# EasyEDA Pro project EXO-IMU3.eprj, schematic Schematic3

## Sheets
1 P1: Create Date: 2024-08-14; Page Name: P1; Project Name: EXO-IMU3; Schematic Name: Schematic3; Update Date: 2024-08-14; Company: EasyEDA.com; Drawed: EasyEDA Pro; Page Size: A4; Part Number: JLCPCB-002; Reviewed: EasyEDA Pro; Version: V0.1
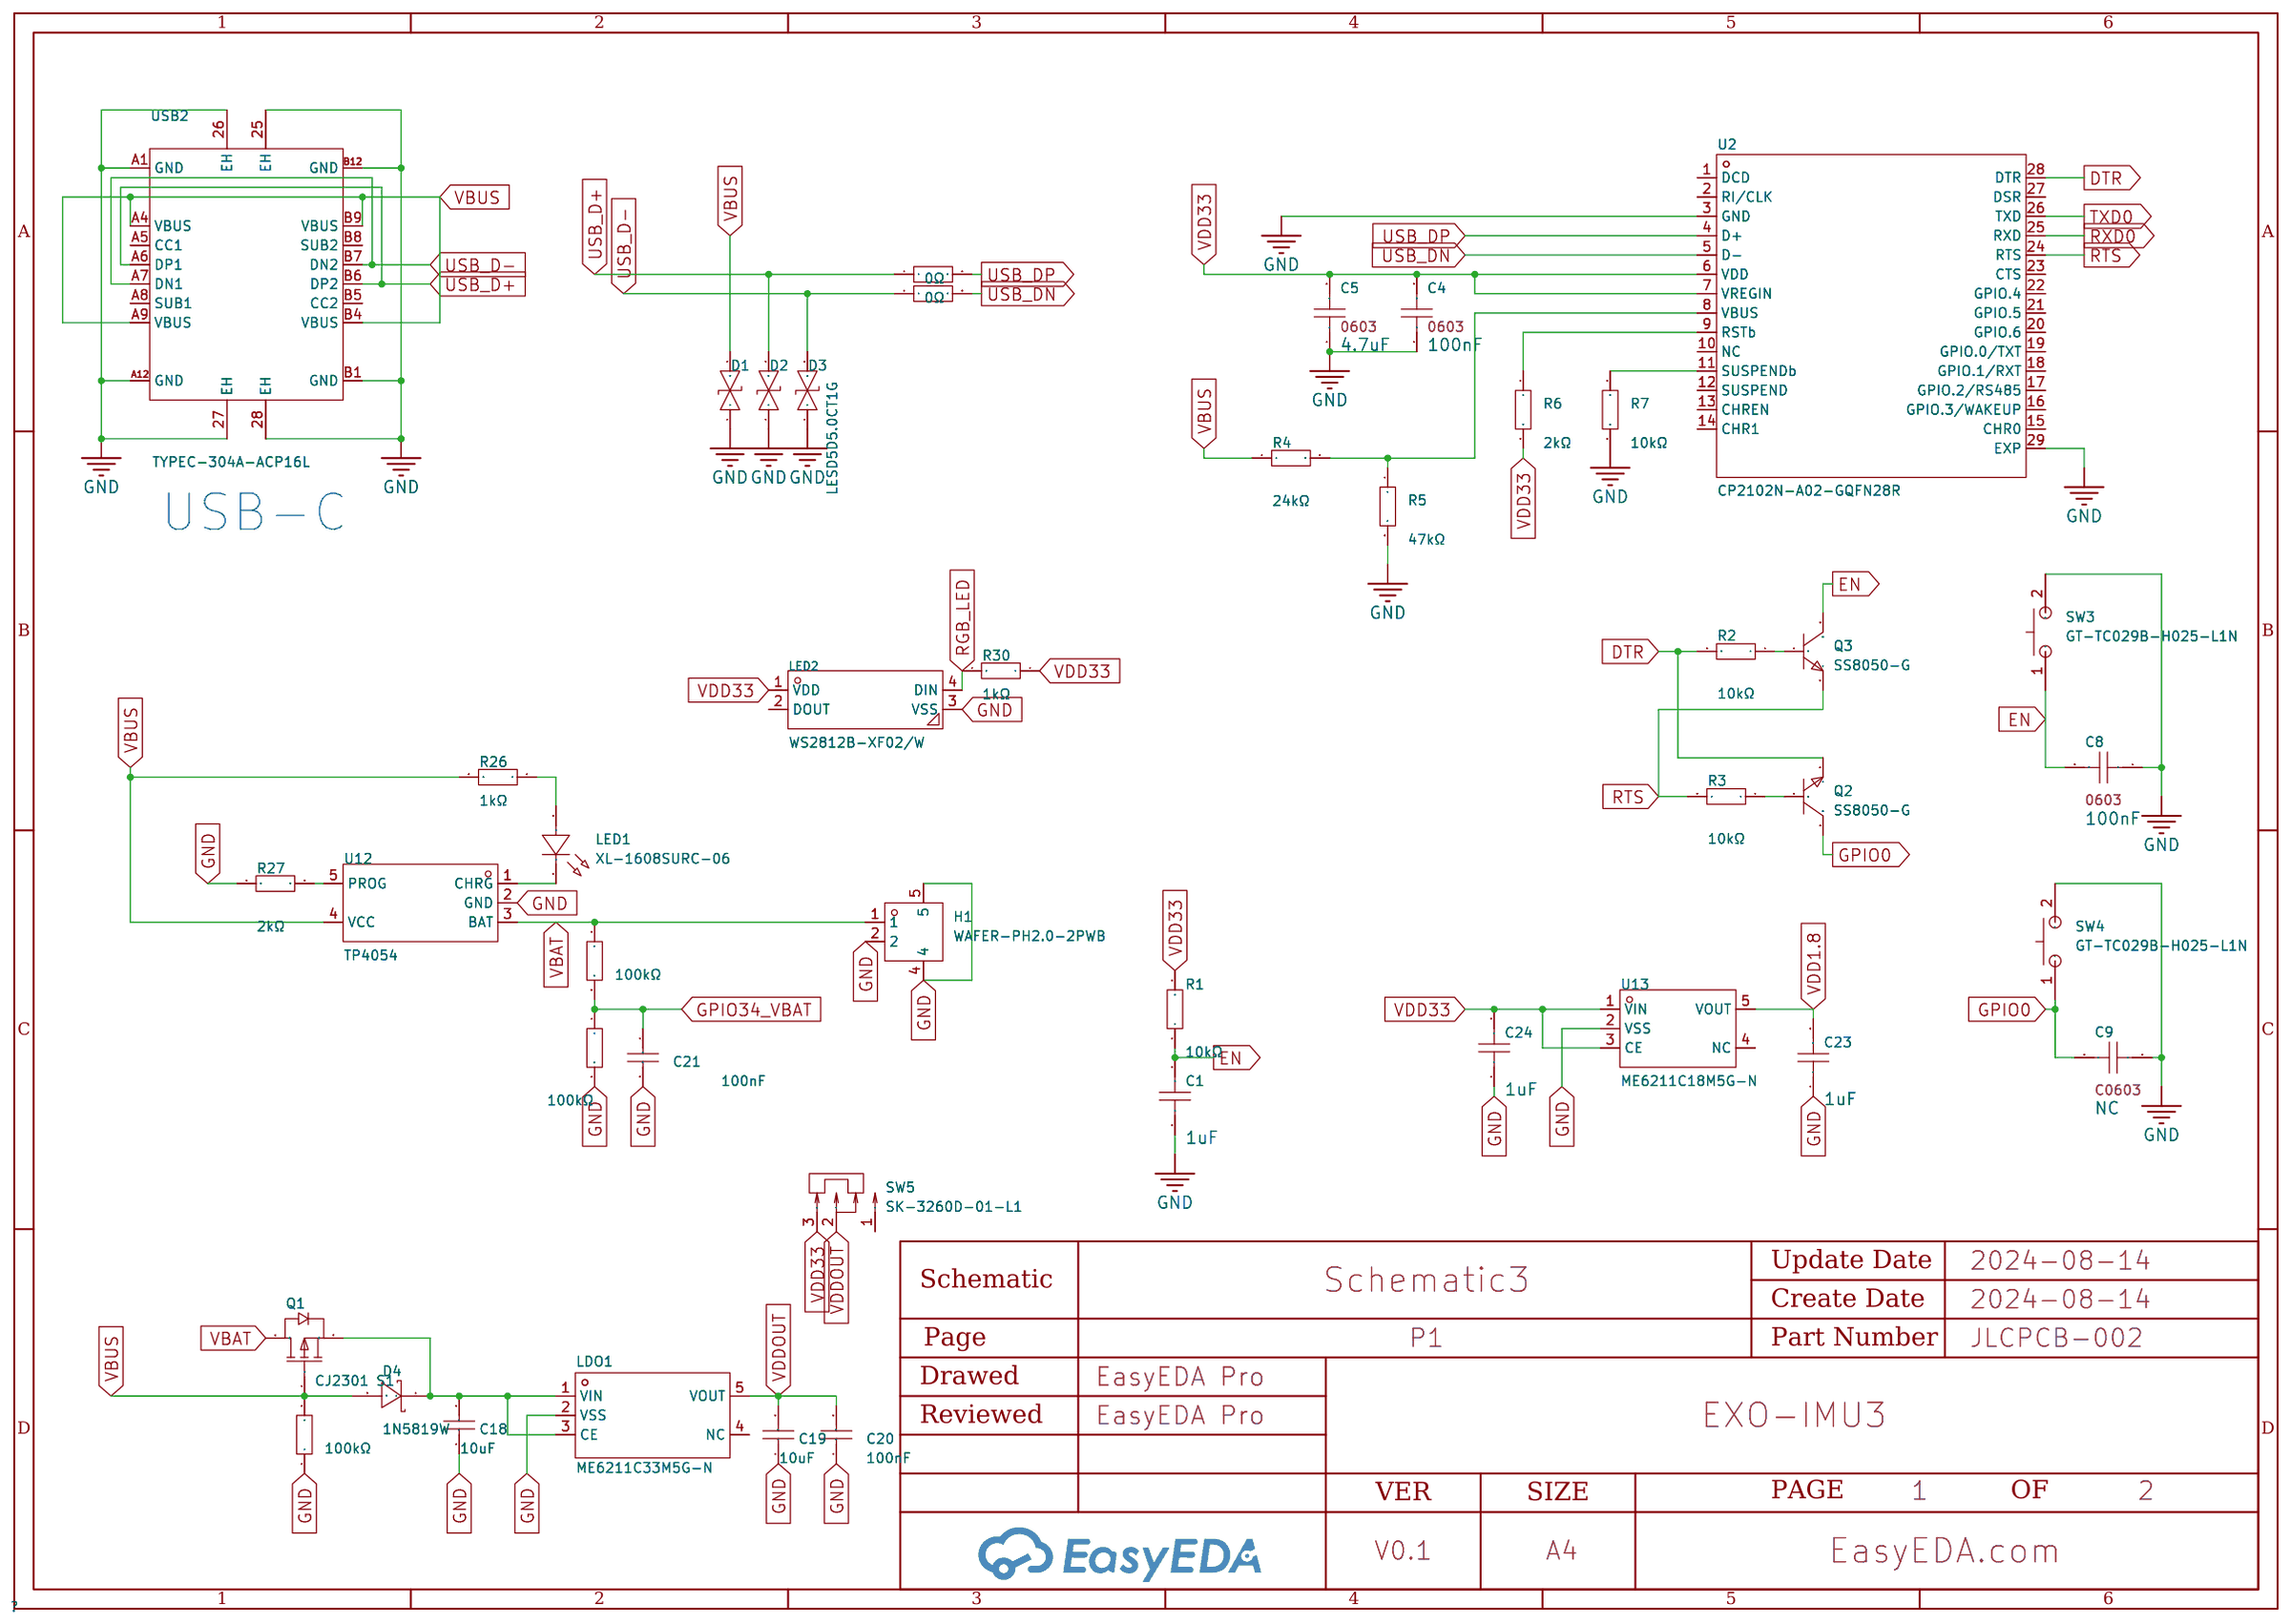
[diagram p0: P1]
2 P2: Page Name: P2; Update Date: 2024-08-15
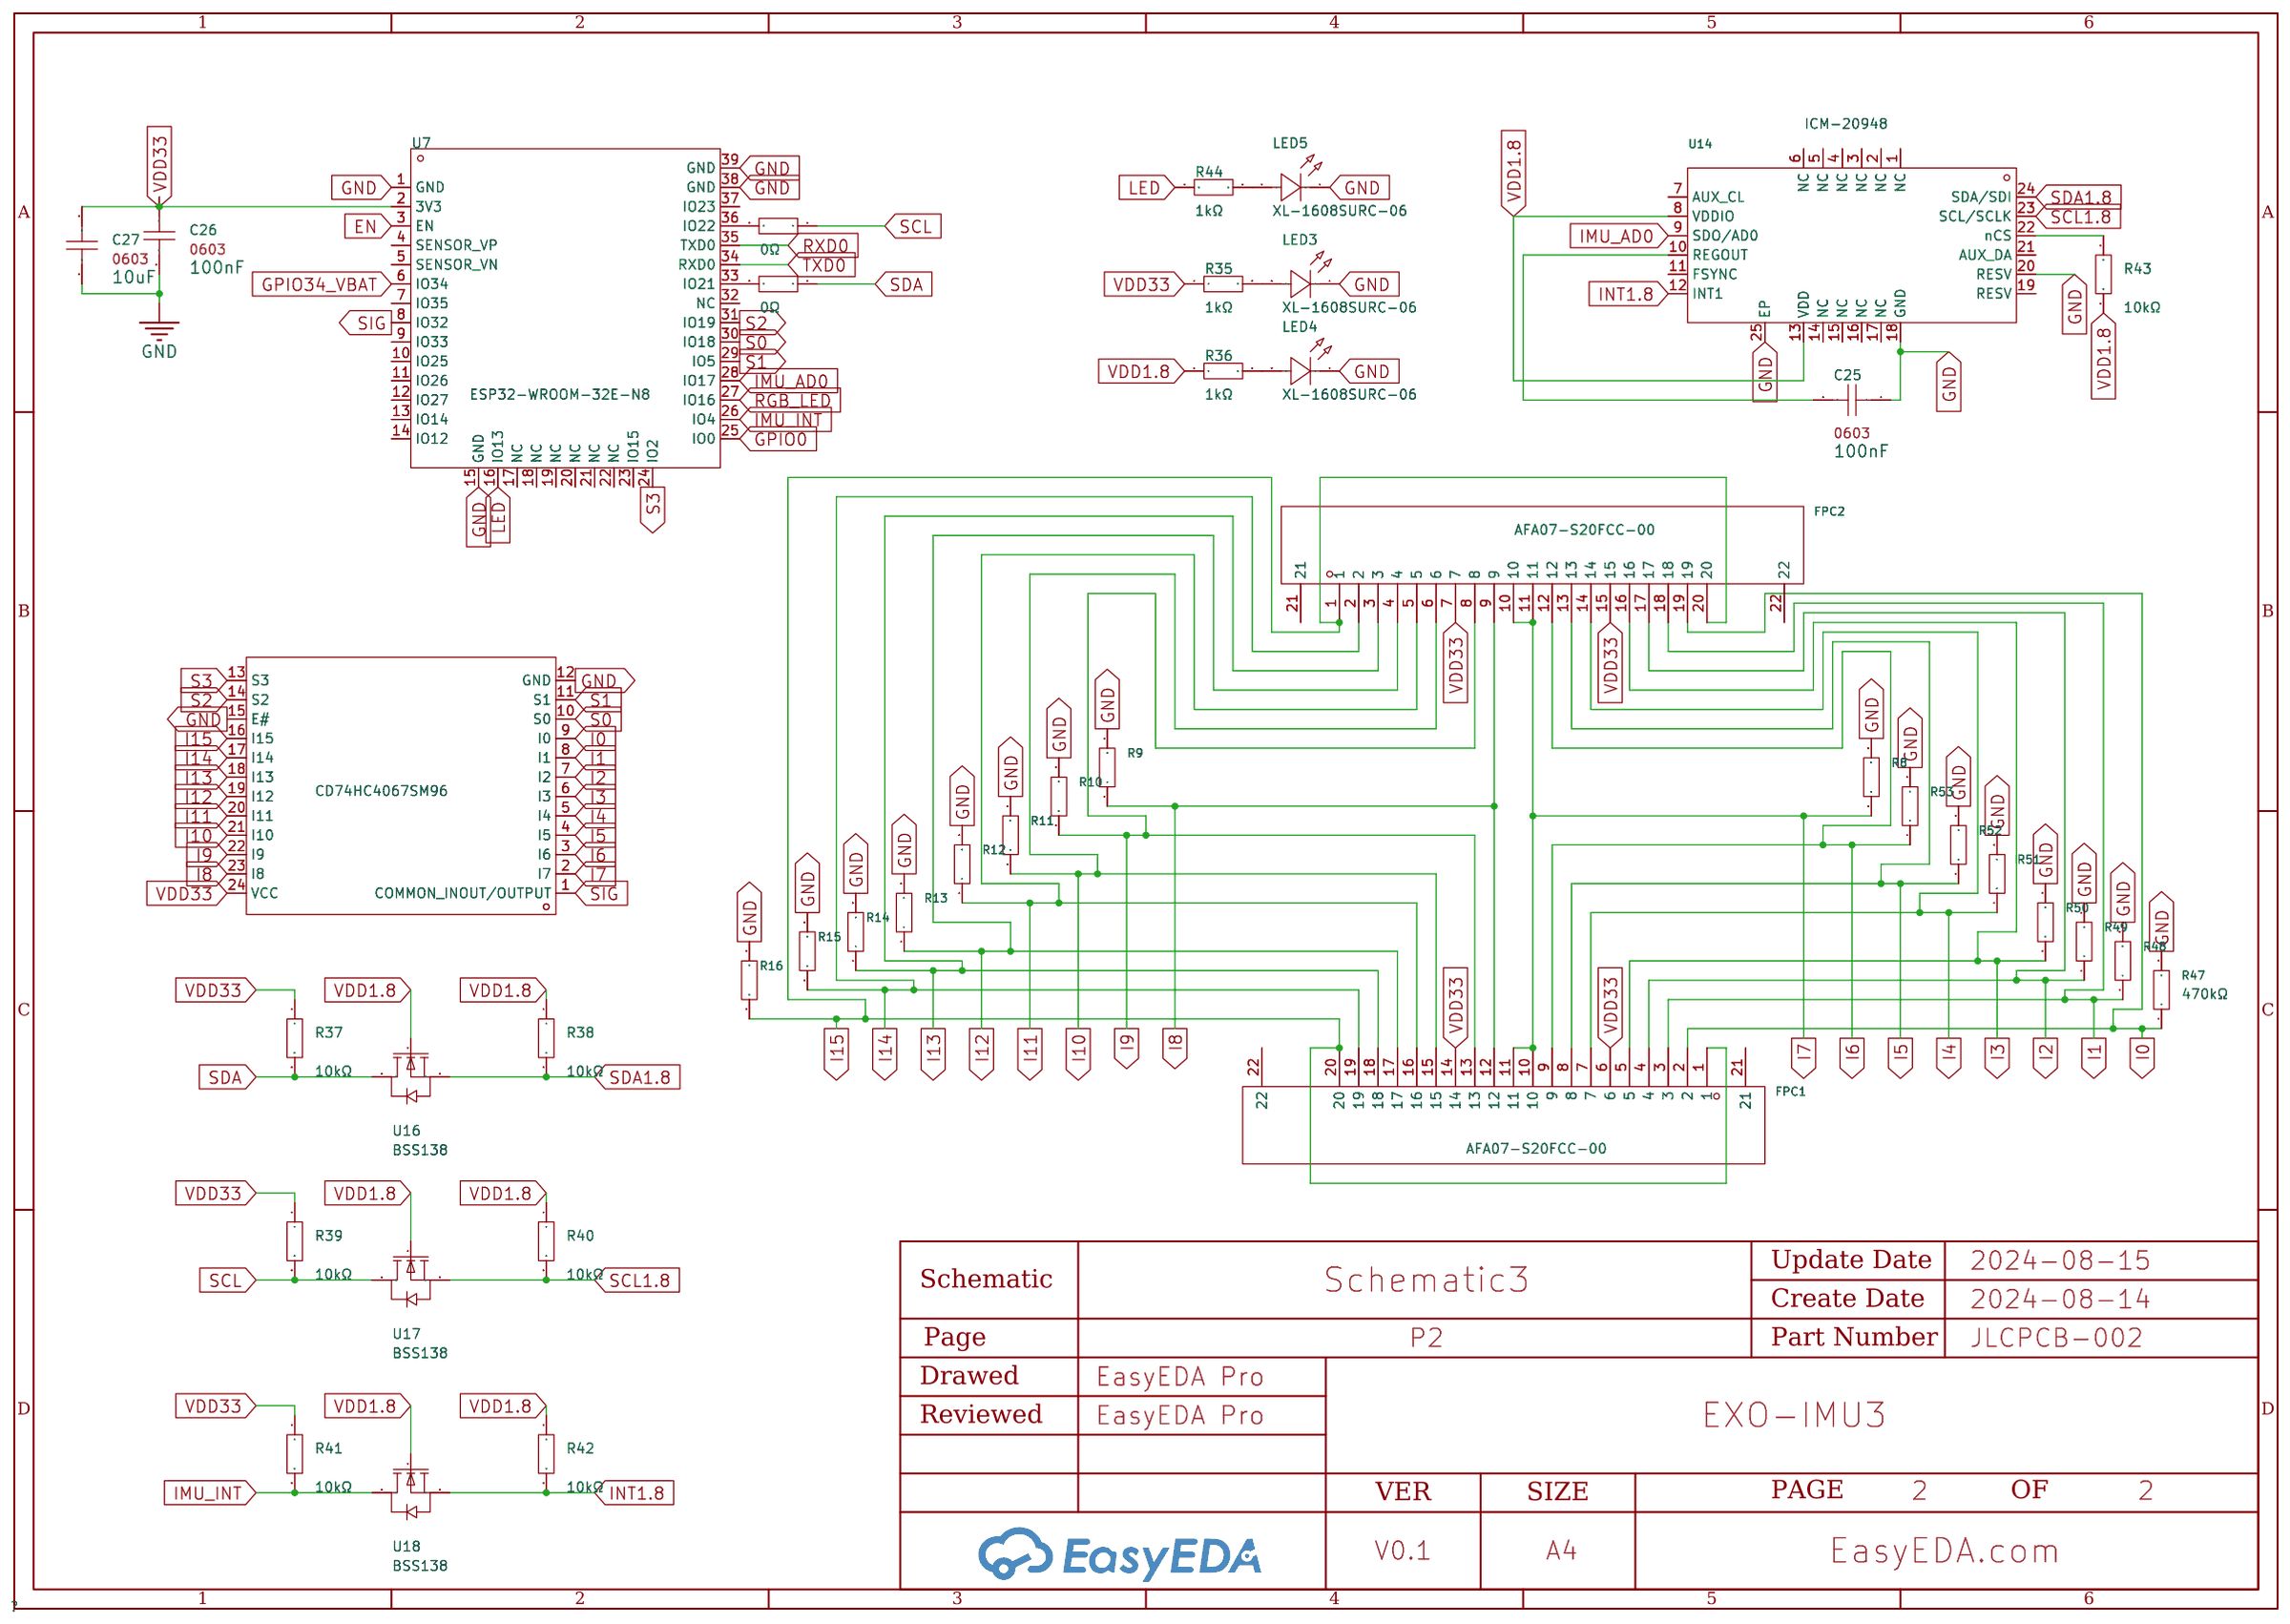
[diagram p1: P2]

## Parts
sheet P1
C1  1uF  [C0603]
C4  100nF  [C0603]
C5  4.7uF  [C0603]
C8  100nF  [C0603]
C9  NC  [C0603]
C18  10uF  [C0603]
C19  10uF  [C0603]
C20  100nF  [C0603]
C21  100nF  [C0603]
C23  1uF  [C0603]
C24  1uF  [C0603]
D1  LESD5D5.0CT1G  [SOD-523_L1.2-W0.8-LS1.6-BI]
D2  LESD5D5.0CT1G  [SOD-523_L1.2-W0.8-LS1.6-BI]
D3  LESD5D5.0CT1G  [SOD-523_L1.2-W0.8-LS1.6-BI]
D4  1N5819W  [SOD-123F_L2.8-W1.8-LS3.7-RD]
H1  WAFER-PH2.0-2PWB  [CONN-SMD_2P-P2.00_XUNPU_WAFER-PH2.0-2PWB]
LDO1  ME6211C33M5G-N  [SOT-23-5_L3.0-W1.7-P0.95-LS2.8-BL]
LED1  XL-1608SURC-06  [LED0603-RD_RED]
LED2  WS2812B-XF02/W  [LED-SMD_4P-L5.0-W5.0-TL]
Q1  CJ2301 S1  [SOT-23-3_L3.0-W1.7-P0.95-LS2.9-BR]
Q2  SS8050-G  [SOT-23-3_L2.9-W1.3-P1.90-LS2.4-BR]
Q3  SS8050-G  [SOT-23-3_L2.9-W1.3-P1.90-LS2.4-BR]
R1  10kΩ  [R0603]
R2  10kΩ  [R0603]
R3  10kΩ  [R0603]
R4  24kΩ  [R0603]
R5  47kΩ  [R0603]
R6  2kΩ  [R0603]
R7  10kΩ  [R0603]
R21  0Ω  [R0603]
R22  0Ω  [R0603]
R25  100kΩ  [R0603]
R26  1kΩ  [R0603]
R27  2kΩ  [R0603]
R28  100kΩ  [R0603]
R29  100kΩ  [R0603]
R30  1kΩ  [R0603]
SW3  GT-TC029B-H025-L1N  [SW-SMD_L3.9-W3.0-P4.45]
SW4  GT-TC029B-H025-L1N  [SW-SMD_L3.9-W3.0-P4.45]
SW5  SK-3260D-01-L1  [SW-TH_SK-3260D-01-LX]
U2  CP2102N-A02-GQFN28R  [QFN-28_L5.0-W5.0-P0.50-TL-EP3.3]
U12  TP4054  [SOT-23-5_L2.9-W1.6-P0.95-LS2.8-BR]
U13  ME6211C18M5G-N  [SOT-23-5_L3.0-W1.7-P0.95-LS2.8-BR]
USB2  TYPEC-304A-ACP16L  [USB-C-SMD_XUNPU_TYPEC-304A-ACP16L]
sheet P2
C25  100nF  [C0603]
C26  100nF  [C0603]
C27  10uF  [C0603]
FPC1  AFA07-S20FCC-00  [FPC-SMD_AFA07-S20FCC-00]
FPC2  AFA07-S20FCC-00  [FPC-SMD_AFA07-S20FCC-00]
LED3  XL-1608SURC-06  [LED0603-RD_RED]
LED4  XL-1608SURC-06  [LED0603-RD_RED]
LED5  XL-1608SURC-06  [LED0603-RD_RED]
R8  470kΩ  [R0805]
R9  470kΩ  [R0805]
R10  470kΩ  [R0805]
R11  470kΩ  [R0805]
R12  470kΩ  [R0805]
R13  470kΩ  [R0805]
R14  470kΩ  [R0805]
R15  470kΩ  [R0805]
R16  470kΩ  [R0805]
R35  1kΩ  [R0603]
R36  1kΩ  [R0603]
R37  10kΩ  [R0603]
R38  10kΩ  [R0603]
R39  10kΩ  [R0603]
R40  10kΩ  [R0603]
R41  10kΩ  [R0603]
R42  10kΩ  [R0603]
R43  10kΩ  [R0603]
R44  1kΩ  [R0603]
R45  0Ω  [R0603]
R46  0Ω  [R0603]
R47  470kΩ  [R0805]
R48  470kΩ  [R0805]
R49  470kΩ  [R0805]
R50  470kΩ  [R0805]
R51  470kΩ  [R0805]
R52  470kΩ  [R0805]
R53  470kΩ  [R0805]
U7  ESP32-WROOM-32E-N8  [WIFI-SMD_ESP32-WROOM-32E]
U14  ICM-20948  [QFN-24_L3.0-W3.0-P0.40-BL-EP]
U16  BSS138  [SOT-23-3_L2.9-W1.3-P1.90-LS2.4-BR]
U17  BSS138  [SOT-23-3_L2.9-W1.3-P1.90-LS2.4-BR]
U18  BSS138  [SOT-23-3_L2.9-W1.3-P1.90-LS2.4-BR]
U19  CD74HC4067SM96  [SSOP-24_L8.1-W5.3-P0.65-LS7.8-BL]

## Library data of the parts
C1 C23 C24 = CL10B105KO8NNNC: Capacitance: Tolerance:±10% Tolerance:±10% Voltage Rated: Temperature Coefficient:; LCSC Part Name: 1uF ±10% 16V; Supplier Part: C59782; Manufacturer: SAMSUNG(三星); Supplier Footprint: 0603; JLCPCB Part Class: Extended Part; Datasheet: https://atta.szlcsc.com/upload/public/pdf/source/20160218/1457707763339.pdf; Supplier: LCSC; Tolerance: ±10%; Check: true
C4 C8 C20 C21 C25 C26 = CC0603KRX7R6BB104: Capacitance: Tolerance:±10% Tolerance:±10% Voltage Rated: Temperature Coefficient:; LCSC Part Name: 100nF ±10% 10V; Supplier Part: C519438; Manufacturer: YAGEO(国巨); Supplier Footprint: 0603; JLCPCB Part Class: Extended Part; Datasheet: https://atta.szlcsc.com/upload/public/pdf/source/20200423/C519438_5D8E3909BA347820A92655F61B0D4FC7.pdf; Supplier: LCSC; Tolerance: ±10%; Check: true
C5 = CL10A475KP8NNNC: Capacitance: Tolerance:±10% Tolerance:±10% Voltage Rated: Temperature Coefficient:; LCSC Part Name: 4.7uF ±10% 10V; Supplier Part: C1705; Manufacturer: SAMSUNG(三星); Supplier Footprint: 0603; JLCPCB Part Class: Extended Part; Datasheet: https://atta.szlcsc.com/upload/public/pdf/source/20160103/1457707692180.pdf; Supplier: LCSC; Tolerance: ±10%; Check: true
C9 = 0603: Supplier Part: C9900021180; JLCPCB Part Class: Extended Part; Datasheet: https://atta.szlcsc.comnull; Supplier: LCSC; Check: true
C18 C19 C27 = CL10A106KP8NNNC: Capacitance: Tolerance:±10% Tolerance:±10% Voltage Rated: Temperature Coefficient:; LCSC Part Name: 10uF ±10% 10V; Supplier Part: C19702; Manufacturer: SAMSUNG(三星); Supplier Footprint: 0603; JLCPCB Part Class: Basic Part; Datasheet: https://atta.szlcsc.com/upload/public/pdf/source/20160103/1457707703378.pdf; Supplier: LCSC; Tolerance: ±10%; Check: true
D1-D3 = LESD5D5.0CT1G: Polarity: Voltage - Reverse Standoff (Typ): Voltage - Breakdown (Min): Voltage - Clamping (Max) @ Ipp: Current - Peak Pulse (10/1000s):; Supplier Part: C383211; Manufacturer: LRC(乐山无线电); Supplier Footprint: SOD-523; JLCPCB Part Class: Extended Part; Datasheet: https://atta.szlcsc.com/upload/public/pdf/source/20190807/C383211_633DF4B4E2C161403226E5235FE33A1C.pdf; Supplier: LCSC; Check: true
D4 = 1N5819W_C169540: Reverse Voltage (Vr):40V Average Rectified Current (Io):1A Forward Voltage (Vf@If):600mV@1A; LCSC Part Name: 40V 1A 600mV@1A; Supplier Part: C169540; Manufacturer: 晶导微电子; Supplier Footprint: SOD-123F; JLCPCB Part Class: Extended Part; Datasheet: https://atta.szlcsc.com/upload/public/pdf/source/20180316/CADAC6127F7EB1C6F7CC209B8BEF97B8.pdf; Supplier: LCSC; Reverse Voltage (Vr): 40V; Average Rectified Current (Io): 1A; Forward Voltage (Vf@If): 600mV@1A; Check: true
H1 = WAFER-PH2.0-2PWB: LCSC Part Name: PH2.0mm 2P 卧贴; Supplier Part: C3029440; Manufacturer: XUNPU(讯普); Supplier Footprint: SMD,P=2.0mm; JLCPCB Part Class: Extended Part; Datasheet: https://atta.szlcsc.com/upload/public/pdf/source/20220527/83903C18429EFE4C9EEE8C529A248431.pdf; Supplier: LCSC; Check: true
LDO1 = ME6211C33M5G-N: Output Type: Output Polarity:Positive Number of Outputs:1 Maximum Input Voltage:6V Output Voltage:3.3V~3.3V Output Voltage:3.3V~3.3V Dropout Voltage:260mV@(200mA) Output Current:500mA Power Supply Rejection Ratio (PSRR):70dB@(1kHz),62dB@(10kHz); Supplier Part: C82942; Manufacturer: MICRONE(南京微盟); Supplier Footprint: SOT-23-5; JLCPCB Part Class: Extended Part; Datasheet: https://atta.szlcsc.com/upload/public/pdf/source/20170918/C82942_1505727073070976520.pdf; Supplier: LCSC; Output Polarity: Positive; Number of Outputs: 1; Maximum Input Voltage: 6V; Output Voltage: 3.3V~3.3V; Dropout Voltage: 260mV@(200mA); Output Current: 500mA; Power Supply Rejection Ratio (PSRR): 70dB@(1kHz),62dB@(10kHz); Check: true
LED1 LED3-LED5 = XL-1608SURC-06: Emitted Color:红灯 Lens Color:Colorless transparence Dominant Wavelength:617nm~621nm Dominant Wavelength:617nm~621nm Peak Wavelength:623nm Color Temperature:- Color Temperature:- Forward Current:25mA Power Dissipation:55mW Viewing Angle:120° Mounting Sytle:; LCSC Part Name: 红灯 正贴; Supplier Part: C965799; Manufacturer: XINGLIGHT(成兴光); Supplier Footprint: 0603; JLCPCB Part Class: Extended Part; Datasheet: https://atta.szlcsc.com/upload/public/pdf/source/20221102/D860AFDD1CDB02C5A8064103A32707E2.pdf; Supplier: LCSC; Emitted Color: 红灯; Lens Color: Colorless transparence; Dominant Wavelength: 617nm~621nm; Peak Wavelength: 623nm; Forward Current: 25mA; Power Dissipation: 55mW; Viewing Angle: 120°; Mounting Sytle: Positive post; Operating Temperature: -30℃~+85℃; Check: true
LED2 = WS2812B-XF02/W: LCSC Part Name: SMD灯珠; Supplier Part: C4154882; Manufacturer: worldsemi; Supplier Footprint: SMD5050; JLCPCB Part Class: Extended Part; Datasheet: https://atta.szlcsc.com/upload/public/pdf/source/20230731/F0C6453512762413726CB8F30593E890.pdf; Supplier: LCSC; Check: true
Q1 = CJ2301 S1: Type: Drain Source Voltage (Vdss): Continuous Drain Current (Id): Power Dissipation (Pd): Drain Source On Resistance (RDS(on)@Vgs,Id):112mΩ@4.5V,2.8A Gate Threshold Voltage (Vgs(th)@Id):1V@250uA Total Gate Charge (Qg@Vgs):- Input Capacitance (Ciss@Vds):-; LCSC Part Name: P沟道 20V 2.3A; Supplier Part: C8547; Manufacturer: CJ(江苏长电/长晶); Supplier Footprint: SOT-23; JLCPCB Part Class: Extended Part; Datasheet: https://atta.szlcsc.com/upload/public/pdf/source/20140815/1457707224119.pdf; Supplier: LCSC; Drain Source On Resistance (RDS(on)@Vgs,Id): 112mΩ@4.5V,2.8A; Gate Threshold Voltage (Vgs(th)@Id): 1V@250uA; Check: true
Q2 Q3 = SS8050-G: Transistor Type:NPN Collector-Emitter Breakdown Voltage (Vceo):25V Collector Current (Ic):1.5A Power Dissipation (Pd):300mW Collector-Emitter Saturation Voltage (VCE(sat)@Ic,Ib):500mV@800mA,80mA DC Current Gain (hFE@Ic,Vce):200@100mA,1V Transition Frequen; LCSC Part Name: SS8050 H档(200-350) H档(200-350); Supplier Part: C164885; Manufacturer: CJ（江苏长电/长晶）; Supplier Footprint: SOT-23(SOT-23-3); JLCPCB Part Class: Extended Part; Datasheet: https://atta.szlcsc.com/upload/public/pdf/source/20171228/C164885_15144412871481213889.pdf; Supplier: LCSC; Transistor Type: NPN; Collector-Emitter Breakdown Voltage (Vceo): 25V; Collector Current (Ic): 1.5A; Power Dissipation (Pd): 300mW; Collector-Emitter Saturation Voltage (VCE(sat)@Ic,Ib): 500mV@800mA,80mA; DC Current Gain (hFE@Ic,Vce): 200@100mA,1V; Transition Frequency (fT): 100MHz; Operating Temperature: +150@(Tj); Check: true
R1-R3 R7 R37-R43 = RC0603JR-0710KL: Type:Thick Film Resistors Resistance: Tolerance:±5% Tolerance:±5% Power(Watts): Temperature Coefficient:±100ppm/ Temperature Coefficient:±100ppm/ Overload Voltage (Max): Operating Temperature Range:-55~+125 Operating Temperature Range:-55~+125; LCSC Part Name: 10kΩ ±5% 100mW; Supplier Part: C99198; Manufacturer: YAGEO(国巨); Supplier Footprint: 0603; JLCPCB Part Class: Extended Part; Datasheet: https://atta.szlcsc.com/upload/public/pdf/source/20181223/C99198_917934A193F41F77D9F7D214A8C79116.pdf; Supplier: LCSC; Type: Thick Film Resistors; Tolerance: ±5%; Temperature Coefficient: ±100ppm/; Operating Temperature Range: -55~+125; Check: true
R4 = 0603WAF2402T5E: Type:Thick Film Resistors Resistance: Tolerance:±1% Tolerance:±1% Power(Watts): Temperature Coefficient:±100ppm/℃ Temperature Coefficient:±100ppm/℃ Overload Voltage (Max): Operating Temperature Range:-55℃~+155℃ Operating Temperature Range:-55℃~+155℃; LCSC Part Name: 24kΩ ±1% 100mW; Supplier Part: C23352; Manufacturer: UNI-ROYAL(厚声); Supplier Footprint: 0603; JLCPCB Part Class: Basic Part; Datasheet: https://atta.szlcsc.com/upload/public/pdf/source/20200306/C422600_1E6D84923E4A46A82E41ADD87F860B5C.pdf; Supplier: LCSC; Type: Thick Film Resistors; Tolerance: ±1%; Temperature Coefficient: ±100ppm/℃; Operating Temperature Range: -55℃~+155℃; Check: true
R5 = RC0603FR-0747KL: Type:Thick Film Resistors Resistance: Tolerance:±1% Tolerance:±1% Power(Watts): Temperature Coefficient:±100ppm/℃ Temperature Coefficient:±100ppm/℃ Overload Voltage (Max): Operating Temperature Range:-55℃~+155℃ Operating Temperature Range:-55℃~+155℃; LCSC Part Name: 47kΩ ±1% 100mW; Supplier Part: C105579; Manufacturer: YAGEO(国巨); Supplier Footprint: 0603; JLCPCB Part Class: Extended Part; Datasheet: https://atta.szlcsc.com/upload/public/pdf/source/20170428/1493376740901.pdf; Supplier: LCSC; Type: Thick Film Resistors; Tolerance: ±1%; Temperature Coefficient: ±100ppm/℃; Operating Temperature Range: -55℃~+155℃; Check: true
R6 R27 = 0603WAF2001T5E: Type:Thick Film Resistors Resistance: Tolerance:±1% Tolerance:±1% Power(Watts): Temperature Coefficient:±100ppm/℃ Temperature Coefficient:±100ppm/℃ Overload Voltage (Max): Operating Temperature Range:-55℃~+155℃ Operating Temperature Range:-55℃~+155℃; LCSC Part Name: 2kΩ ±1% 100mW; Supplier Part: C22975; Manufacturer: UNI-ROYAL(厚声); Supplier Footprint: 0603; JLCPCB Part Class: Basic Part; Datasheet: https://atta.szlcsc.com/upload/public/pdf/source/20200306/C422600_1E6D84923E4A46A82E41ADD87F860B5C.pdf; Supplier: LCSC; Type: Thick Film Resistors; Tolerance: ±1%; Temperature Coefficient: ±100ppm/℃; Operating Temperature Range: -55℃~+155℃; Check: true
R21 R22 R45 R46 = 0603WAF0000T5E: Type:Thick Film Resistors Resistance: Tolerance:±1% Tolerance:±1% Power(Watts): Overload Voltage (Max): Operating Temperature Range:-55℃~+155℃ Operating Temperature Range:-55℃~+155℃; LCSC Part Name: 0Ω ±1% 100mW; Supplier Part: C21189; Manufacturer: UNI-ROYAL(厚声); Supplier Footprint: 0603; JLCPCB Part Class: Basic Part; Datasheet: https://atta.szlcsc.com/upload/public/pdf/source/20200306/C422600_1E6D84923E4A46A82E41ADD87F860B5C.pdf; Supplier: LCSC; Type: Thick Film Resistors; Tolerance: ±1%; Operating Temperature Range: -55℃~+155℃; Temperature Coefficient: ±100ppm/; Check: true
R25 R28 R29 = 0603WAF1003T5E: Type:Thick Film Resistors Resistance: Tolerance:±1% Tolerance:±1% Power(Watts): Temperature Coefficient:±100ppm/℃ Temperature Coefficient:±100ppm/℃ Overload Voltage (Max): Operating Temperature Range:-55℃~+155℃ Operating Temperature Range:-55℃~+155℃; LCSC Part Name: 100kΩ ±1% 100mW; Supplier Part: C25803; Manufacturer: UNI-ROYAL(厚声); Supplier Footprint: 0603; JLCPCB Part Class: Basic Part; Datasheet: https://atta.szlcsc.com/upload/public/pdf/source/20200306/C422600_1E6D84923E4A46A82E41ADD87F860B5C.pdf; Supplier: LCSC; Type: Thick Film Resistors; Tolerance: ±1%; Temperature Coefficient: ±100ppm/℃; Operating Temperature Range: -55℃~+155℃; Check: true
R26 R30 R35 R36 R44 = 0603WAF1001T5E: Type:Thick Film Resistors Resistance: Tolerance:±1% Tolerance:±1% Power(Watts): Temperature Coefficient:±100ppm/℃ Temperature Coefficient:±100ppm/℃ Overload Voltage (Max): Operating Temperature Range:-55℃~+155℃ Operating Temperature Range:-55℃~+155℃; LCSC Part Name: 1kΩ ±1% 100mW; Supplier Part: C21190; Manufacturer: UNI-ROYAL(厚声); Supplier Footprint: 0603; JLCPCB Part Class: Basic Part; Datasheet: https://atta.szlcsc.com/upload/public/pdf/source/20200306/C422600_1E6D84923E4A46A82E41ADD87F860B5C.pdf; Supplier: LCSC; Type: Thick Film Resistors; Tolerance: ±1%; Temperature Coefficient: ±100ppm/℃; Operating Temperature Range: -55℃~+155℃; Check: true
SW3 SW4 = GT-TC029B-H025-L1N: Contact Current:50mA Voltage Rating (DC):12V Insulation Resistance:100MΩ Circuit:SPST Mounting Style:Brick nogging Actuator Style:Round Button Actuator/Cap Color:Black With Lamp:No Operating Force:250gf@±30gf Mechanical Life:100000次 Operating Temperature:; LCSC Part Name: 3.9*2.9*2.5mm 立贴 轻触开关; Supplier Part: C843669; Manufacturer: G-Switch(品赞); Supplier Footprint: SMD; JLCPCB Part Class: Extended Part; Datasheet: https://atta.szlcsc.com/upload/public/pdf/source/20201014/C843665_B07D254A2E90B746498E934B945CCD5F.pdf; Supplier: LCSC; Contact Current: 50mA; Voltage Rating (DC): 12V; Insulation Resistance: 100MΩ; Circuit: SPST; Mounting Style: Brick nogging; Actuator Style: Round Button; Actuator/Cap Color: Black; With Lamp: No; Operating Force: 250gf@±30gf; Mechanical Life: 100000次; Operating Temperature: -30℃~+85℃; Pin Style: SMDSplicing; Switch Length: 3.9mm; Switch Width: 2.9mm; Switch Height: 2.5mm; Strike Gundam: NO; Check: true
SW5 = SK-3260D-01-L1: Current Rating (DC):50mA Voltage Rating (DC):12V Current Rating (AC):50mA Voltage Rating (AC):12V Circuit:SPDT Mounting Style:Lying Mechanical Life:10000次 Actuator Color:Black Actuator Style:Rectangular columnar Pin Style:PCPin Operating Temperature:-40℃~; LCSC Part Name: 柄长2mm 卧插双档 滑动开关; Supplier Part: C466004; Manufacturer: XKB Connectivity(中国星坤); Supplier Footprint: 插件; JLCPCB Part Class: Extended Part; Datasheet: https://atta.szlcsc.com/upload/public/pdf/source/20211009/221EDC0F79A971BF29F08D53B29B73D7.pdf; Supplier: LCSC; Current Rating (DC): 50mA; Voltage Rating (DC): 12V; Current Rating (AC): 50mA; Voltage Rating (AC): 12V; Circuit: SPDT; Mounting Style: Lying; Mechanical Life: 10000次; Actuator Color: Black; Actuator Style: Rectangular columnar; Pin Style: PCPin; Operating Temperature: -40℃~+85℃; Switch Length: 9mm; Switch Width: 3.5mm; Switch Height: 3.6mm; Check: true
U2 = CP2102N-A02-GQFN28R: Type: Protocol: Number of Drivers/Receivers: Data Rate: Supply Voltage:; Supplier Part: C964632; Manufacturer: SILICON LABS(芯科); Supplier Footprint: QFN-28; JLCPCB Part Class: Extended Part; Datasheet: https://atta.szlcsc.com/upload/public/pdf/source/20201204/C964632_F2B790CC23A72455AEF523510305B30A.pdf; Supplier: LCSC; Check: true
U12 = TP4054_2: Supplier Part: C5381776; Manufacturer: JSMSEMI(杰盛微); Supplier Footprint: SOT-23-5; JLCPCB Part Class: Extended Part; Datasheet: https://atta.szlcsc.com/upload/public/pdf/source/20230320/C1B24D3FEFC06E430E9E3FAE771EF911.pdf; Supplier: LCSC; Check: true
U13 = ME6211C18M5G-N: Output Type: Output Polarity:Positive Number of Outputs:1 Maximum Input Voltage:6.5V Output Voltage:1.8V Output Voltage:1.8V Dropout Voltage:400mV@(200mA) Output Current:300mA Power Supply Rejection Ratio (PSRR):70dB@(1kHz); LCSC Part Name: 输入6.5V 输出1.8V~1.8V 300mA; Supplier Part: C236671; Manufacturer: MICRONE(南京微盟); Supplier Footprint: SOT-23-5; JLCPCB Part Class: Extended Part; Datasheet: https://atta.szlcsc.com/upload/public/pdf/source/20180801/C94042_8FDAFF138ADDED65E3D077205E9A8C17.pdf; Supplier: LCSC; Output Polarity: Positive; Number of Outputs: 1; Maximum Input Voltage: 6.5V; Output Voltage: 1.8V; Dropout Voltage: 400mV@(200mA); Output Current: 300mA; Power Supply Rejection Ratio (PSRR): 70dB@(1kHz)
USB2 = TYPEC-304A-ACP16L: Connector Type:Type-C Standard:USB 3.1 Gender:Female Number of Contacts:16 Number of Ports:1 Mounting Style:Surface Mount Current Rating - Power (Max):5A Operating Temperature Range:-45℃~+85℃ Operating Temperature Range:-45℃~+85℃ Welding Temperature (Max); LCSC Part Name: Type-C 母座 卧贴; Supplier Part: C2909609; Manufacturer: XUNPU(讯普); Supplier Footprint: SMD; JLCPCB Part Class: Extended Part; Datasheet: https://atta.szlcsc.com/upload/public/pdf/source/20211029/5A76838C591B377E5BF09726BF37DE5A.pdf; Supplier: LCSC; Connector Type: Type-C; Standard: USB 3.1; Gender: Female; Number of Contacts: 16; Number of Ports: 1; Mounting Style: Surface Mount; Current Rating - Power (Max): 5A; Operating Temperature Range: -45℃~+85℃; Welding Temperature (Max): 260℃; Check: true
FPC1 FPC2 = AFA07-S20FCC-00: Locking Feature:抽屉式 Contact Type:Bottom Contact Number of Contacts:20P Pitch:1mm Mounting Type:卧贴 FFC, FCB Thickness:0.3mm FFC, FCB Thickness:0.3mm Height Above Board:2.5mm; LCSC Part Name: 间距:1mm P数:20P 抽屉式 下接; Supplier Part: C262352; Manufacturer: JS(钜硕电子); Supplier Footprint: SMD,P=1mm,卧贴; Datasheet: https://atta.szlcsc.com/upload/public/pdf/source/20191217/C262716_30B15E9A77BFCA4A54741C92DB3BE8CC.pdf; Supplier: LCSC; Locking Feature: 抽屉式; Contact Type: Bottom Contact; Number of Contacts: 20P; Pitch: 1mm; Mounting Type: 卧贴; FFC, FCB Thickness: 0.3mm; Height Above Board: 2.5mm
R8-R16 R47-R53 = 0805W8F4703T5E: Type:Thick Film Resistors Resistance:470kΩ Tolerance:±1% Tolerance:±1% Power(Watts): Overload Voltage (Max): Temperature Coefficient:±100ppm/℃ Temperature Coefficient:±100ppm/℃ Operating Temperature Range:-55℃~+155℃ Operating Temperature Range:-55℃~+155℃; LCSC Part Name: 470kΩ ±1% 125mW 厚膜电阻; Supplier Part: C17709; Manufacturer: UNI-ROYAL(厚声); Supplier Footprint: 0805; Datasheet: https://atta.szlcsc.com/upload/public/pdf/source/20200306/C422600_1E6D84923E4A46A82E41ADD87F860B5C.pdf; Supplier: LCSC; Type: Thick Film Resistors; Tolerance: ±1%; Temperature Coefficient: ±100ppm/℃; Operating Temperature Range: -55℃~+155℃
U7 = ESP32-WROOM-32E-N8: Supplier Part: C2973651; Manufacturer: ESPRESSIF(乐鑫); Supplier Footprint: 模块; JLCPCB Part Class: Extended Part; Datasheet: https://atta.szlcsc.com/upload/public/pdf/source/20220601/0020821B65DE5740BBACA5FACC5CF3B6.pdf; Supplier: LCSC
U14 = ICM-20948: Sensor Type:加速度计陀螺仪 Operating Temperature:-40℃~+85℃ Operating Temperature:-40℃~+85℃; Supplier Part: C726001; Manufacturer: TDK InvenSense(应美盛); Supplier Footprint: QFN-24(3x3); JLCPCB Part Class: Extended Part; Datasheet: https://atta.szlcsc.com/upload/public/pdf/source/20210715/C726001_EFE09342631EBC06FA98BEAE6CEEEE9D.pdf; Supplier: LCSC; Sensor Type: 加速度计陀螺仪; Operating Temperature: -40℃~+85℃
U16-U18 = BSS138_C7420339: Supplier Part: C7420339; Manufacturer: 宏迦橙; Supplier Footprint: SOT-23; Datasheet: https://atta.szlcsc.com/upload/public/pdf/source/20230621/4297BE735E152322F85FF19A1FC05A85.pdf; Supplier: LCSC
U19 = CD74HC4067SM96: Switch Circuit:-; Supplier Part: C98457; Manufacturer: TI(德州仪器); Supplier Footprint: SSOP-24-208mil; JLCPCB Part Class: Extended Part; Datasheet: https://www.ti.com/cn/lit/gpn/cd74hc4067; Supplier: LCSC

## Nets
GND: C1.1 C4.1 C5.1 C8.1 C9.1 C18.1 C19.1 C20.1 C21.2 C23.1 C24.1 C25.1 C26.1 C27.1 D1.1 D2.1 D3.1 H1.2 H1.4 H1.5 LDO1.2(VSS) LED2.3(VSS) LED3.1(K) LED4.1(K) LED5.1(K) R5.2 R7.2 R8.2 R9.2 R10.2 R11.2 R12.2 R13.2 R14.2 R15.2 R16.2 R25.1 R27.1 R28.2 R47.2 R48.2 R49.2 R50.2 R51.2 R52.2 R53.2 SW3.2 SW4.2 U2.3(GND) U2.29(EXP) U7.1(GND) U7.15(GND) U7.38(GND) U7.39(GND) U12.2(GND) U13.2(VSS) U14.18(GND) U14.20(RESV) U14.25(EP) U19.12(GND) U19.15(E#) USB2.25(EH) USB2.26(EH) USB2.27(EH) USB2.28(EH) USB2.A1(GND) USB2.A12(GND) USB2.B1(GND) USB2.B12(GND)
VBAT: H1.1 Q1.3(D) R29.1 U12.3(BAT)
VBUS: D1.2 D4.2 Q1.1(G) R4.1 R25.2 R26.2 U12.4(VCC) USB2.A4(VBUS) USB2.A9(VBUS) USB2.B4(VBUS) USB2.B9(VBUS)
VDD1.8: C23.2 R36.1 R38.1 R40.1 R42.1 R43.2 U13.5(VOUT) U14.8(VDDIO) U14.13(VDD) U16.1(G) U17.1(G) U18.1(G)
VDD33: C4.2 C5.2 C24.2 C26.2 C27.2 FPC1.6 FPC1.14 FPC2.7 FPC2.15 LED2.1(VDD) R1.2 R6.2 R30.1 R35.1 R37.1 R39.1 R41.1 SW5.3 U2.6(VDD) U2.7(VREGIN) U7.2(3V3) U13.1(VIN) U13.3(CE) U19.24(VCC)
VDDOUT: C19.2 C20.2 LDO1.5(VOUT) SW5.2
DTR: Q2.2(E) R2.2 U2.28(DTR)
EN: C1.2 C8.2 Q3.3(C) R1.1 SW3.1 U7.3(EN)
GPIO0: C9.2 Q2.3(C) SW4.1 U7.25(IO0)
GPIO34_VBAT: C21.1 R28.1 R29.2 U7.6(IO34)
I0: FPC1.2 FPC2.19 R47.1 U19.9(I0)
I1: FPC1.3 FPC2.18 R48.1 U19.8(I1)
I2: FPC1.4 FPC2.17 R49.1 U19.7(I2)
I3: FPC1.5 FPC2.16 R50.1 U19.6(I3)
I4: FPC1.7 FPC2.14 R51.1 U19.5(I4)
I5: FPC1.8 FPC2.13 R52.1 U19.4(I5)
I6: FPC1.9 FPC2.12 R53.1 U19.3(I6)
I7: FPC1.10 FPC1.11 FPC2.10 FPC2.11 R8.1 U19.2(I7)
I8: FPC1.12 FPC2.9 R9.1 U19.23(I8)
I9: FPC1.13 FPC2.8 R10.1 U19.22(I9)
I10: FPC1.15 FPC2.6 R11.1 U19.21(I10)
I11: FPC1.16 FPC2.5 R12.1 U19.20(I11)
I12: FPC1.17 FPC2.4 R13.1 U19.19(I12)
I13: FPC1.18 FPC2.3 R14.1 U19.18(I13)
I14: FPC1.19 FPC2.2 R15.1 U19.17(I14)
I15: FPC1.1 FPC1.20 FPC2.1 FPC2.20 R16.1 U19.16(I15)
IMU_AD0: U7.28(IO17) U14.9(SDO/AD0)
IMU_INT: R41.2 U7.26(IO4) U18.3(D)
INT1.8: R42.2 U14.12(INT1) U18.2(S)
LED: R44.1 U7.16(IO13)
RGB_LED: LED2.4(DIN) R30.2 U7.27(IO16)
RTS: Q3.2(E) R3.2 U2.24(RTS)
RXD0: U2.25(RXD) U7.35(TXD0)
S0: U7.30(IO18) U19.10(S0)
S1: U7.29(IO5) U19.11(S1)
S2: U7.31(IO19) U19.14(S2)
S3: U7.24(IO2) U19.13(S3)
SCL: R39.2 R45.1 U17.3(D)
SCL1.8: R40.2 U14.23(SCL/SCLK) U17.2(S)
SDA: R37.2 R46.1 U16.3(D)
SDA1.8: R38.2 U14.24(SDA/SDI) U16.2(S)
SIG: U7.8(IO32) U19.1(COMMON INOUT/OUTPUT)
TXD0: U2.26(TXD) U7.34(RXD0)
USB_D+: D2.2 R22.1 USB2.A6(DP1) USB2.B6(DP2)
USB_D-: D3.2 R21.1 USB2.A7(DN1) USB2.B7(DN2)
USB_DN: R21.2 U2.5(D-)
USB_DP: R22.2 U2.4(D+)
$1N3259: R4.2 R5.1 U2.8(VBUS)
$1N3261: R6.1 U2.9(RSTb)
$1N3262: R7.1 U2.11(SUSPENDb)
$1N3278: C18.2 D4.1 LDO1.1(VIN) LDO1.3(CE) Q1.2(S)
$1N3281: R27.2 U12.5(PROG)
$1N3284: LED1.2(A) R26.1
$1N3285: LED1.1(K) U12.1(CHRG)
$1N3293: Q3.1(B) R2.1
$1N3296: Q2.1(B) R3.1
$2N1366: LED3.2(A) R35.2
$2N1372: LED4.2(A) R36.2
$2N1399: R43.1 U14.22(nCS)
$2N1403: C25.2 U14.10(REGOUT)
$2N1405: LED5.2(A) R44.2
$2N1424: R45.2 U7.36(IO22)
$2N1426: R46.2 U7.33(IO21)

Not connected (* = marked no-connect by the designer): FPC1 21 22; FPC2 21 22; LDO1 4(NC); LED2 2(DOUT); SW5 1; U2 1(DCD) 2(RI/CLK) 10(NC) 12(SUSPEND) 13(CHREN) 14(CHR1) 15(CHR0) 16(GPIO.3/WAKEUP) 17(GPIO.2/RS485) 18(GPIO.1/RXT) 19(GPIO.0/TXT) 20(GPIO.6) 21(GPIO.5) 22(GPIO.4) 23(CTS) 27(DSR); U7 4(SENSOR_VP) 5(SENSOR_VN) 7(IO35) 9(IO33) 10(IO25) 11(IO26) 12(IO27) 13(IO14) 14(IO12) 17(NC) 18(NC) 19(NC) 20(NC) 21(NC) 22(NC) 23(IO15) 32(NC) 37(IO23); U13 4(NC); U14 1(NC) 2(NC) 3(NC) 4(NC) 5(NC) 6(NC) 7(AUX_CL) 11(FSYNC) 14(NC) 15(NC) 16(NC) 17(NC) 19(RESV) 21(AUX_DA); USB2 A5(CC1) A8(SUB1) B5(CC2) B8(SUB2)

## Notes on the sheets
sheet 1
- USB-C
